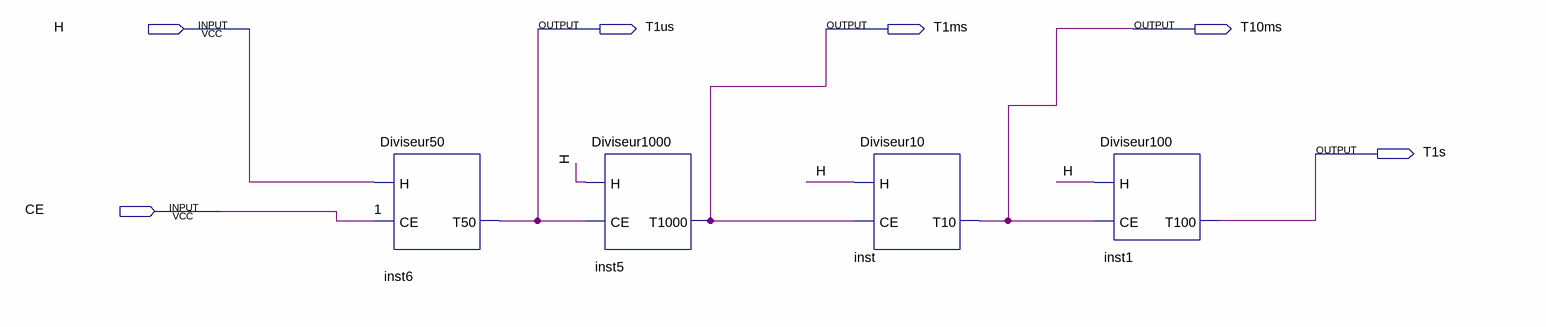
[diagram p0: schematic sheet]
// Quartus schematic BaseDeTemps.bdf as structural Verilog: 4 symbols, 6 pins
module BaseDeTemps (
  input  H,
  input  CE,
  output T1us,
  output T1ms,
  output T10ms,
  output T1s
);

  Diviseur50 inst6 (.H(H), .CE(CE), .T50(T1us));
  Diviseur1000 inst5 (.H(H), .CE(T1us), .T1000(T1ms));
  Diviseur10 inst (.H(H), .CE(T1ms), .T10(T10ms));
  Diviseur100 inst1 (.H(H), .CE(T10ms), .T100(T1s));

  // Other names for the same wires on the sheet: 1 = CE
endmodule
